# EAGLE schematic ZEGAR_WS2812 (EAGLE 9.6.0)
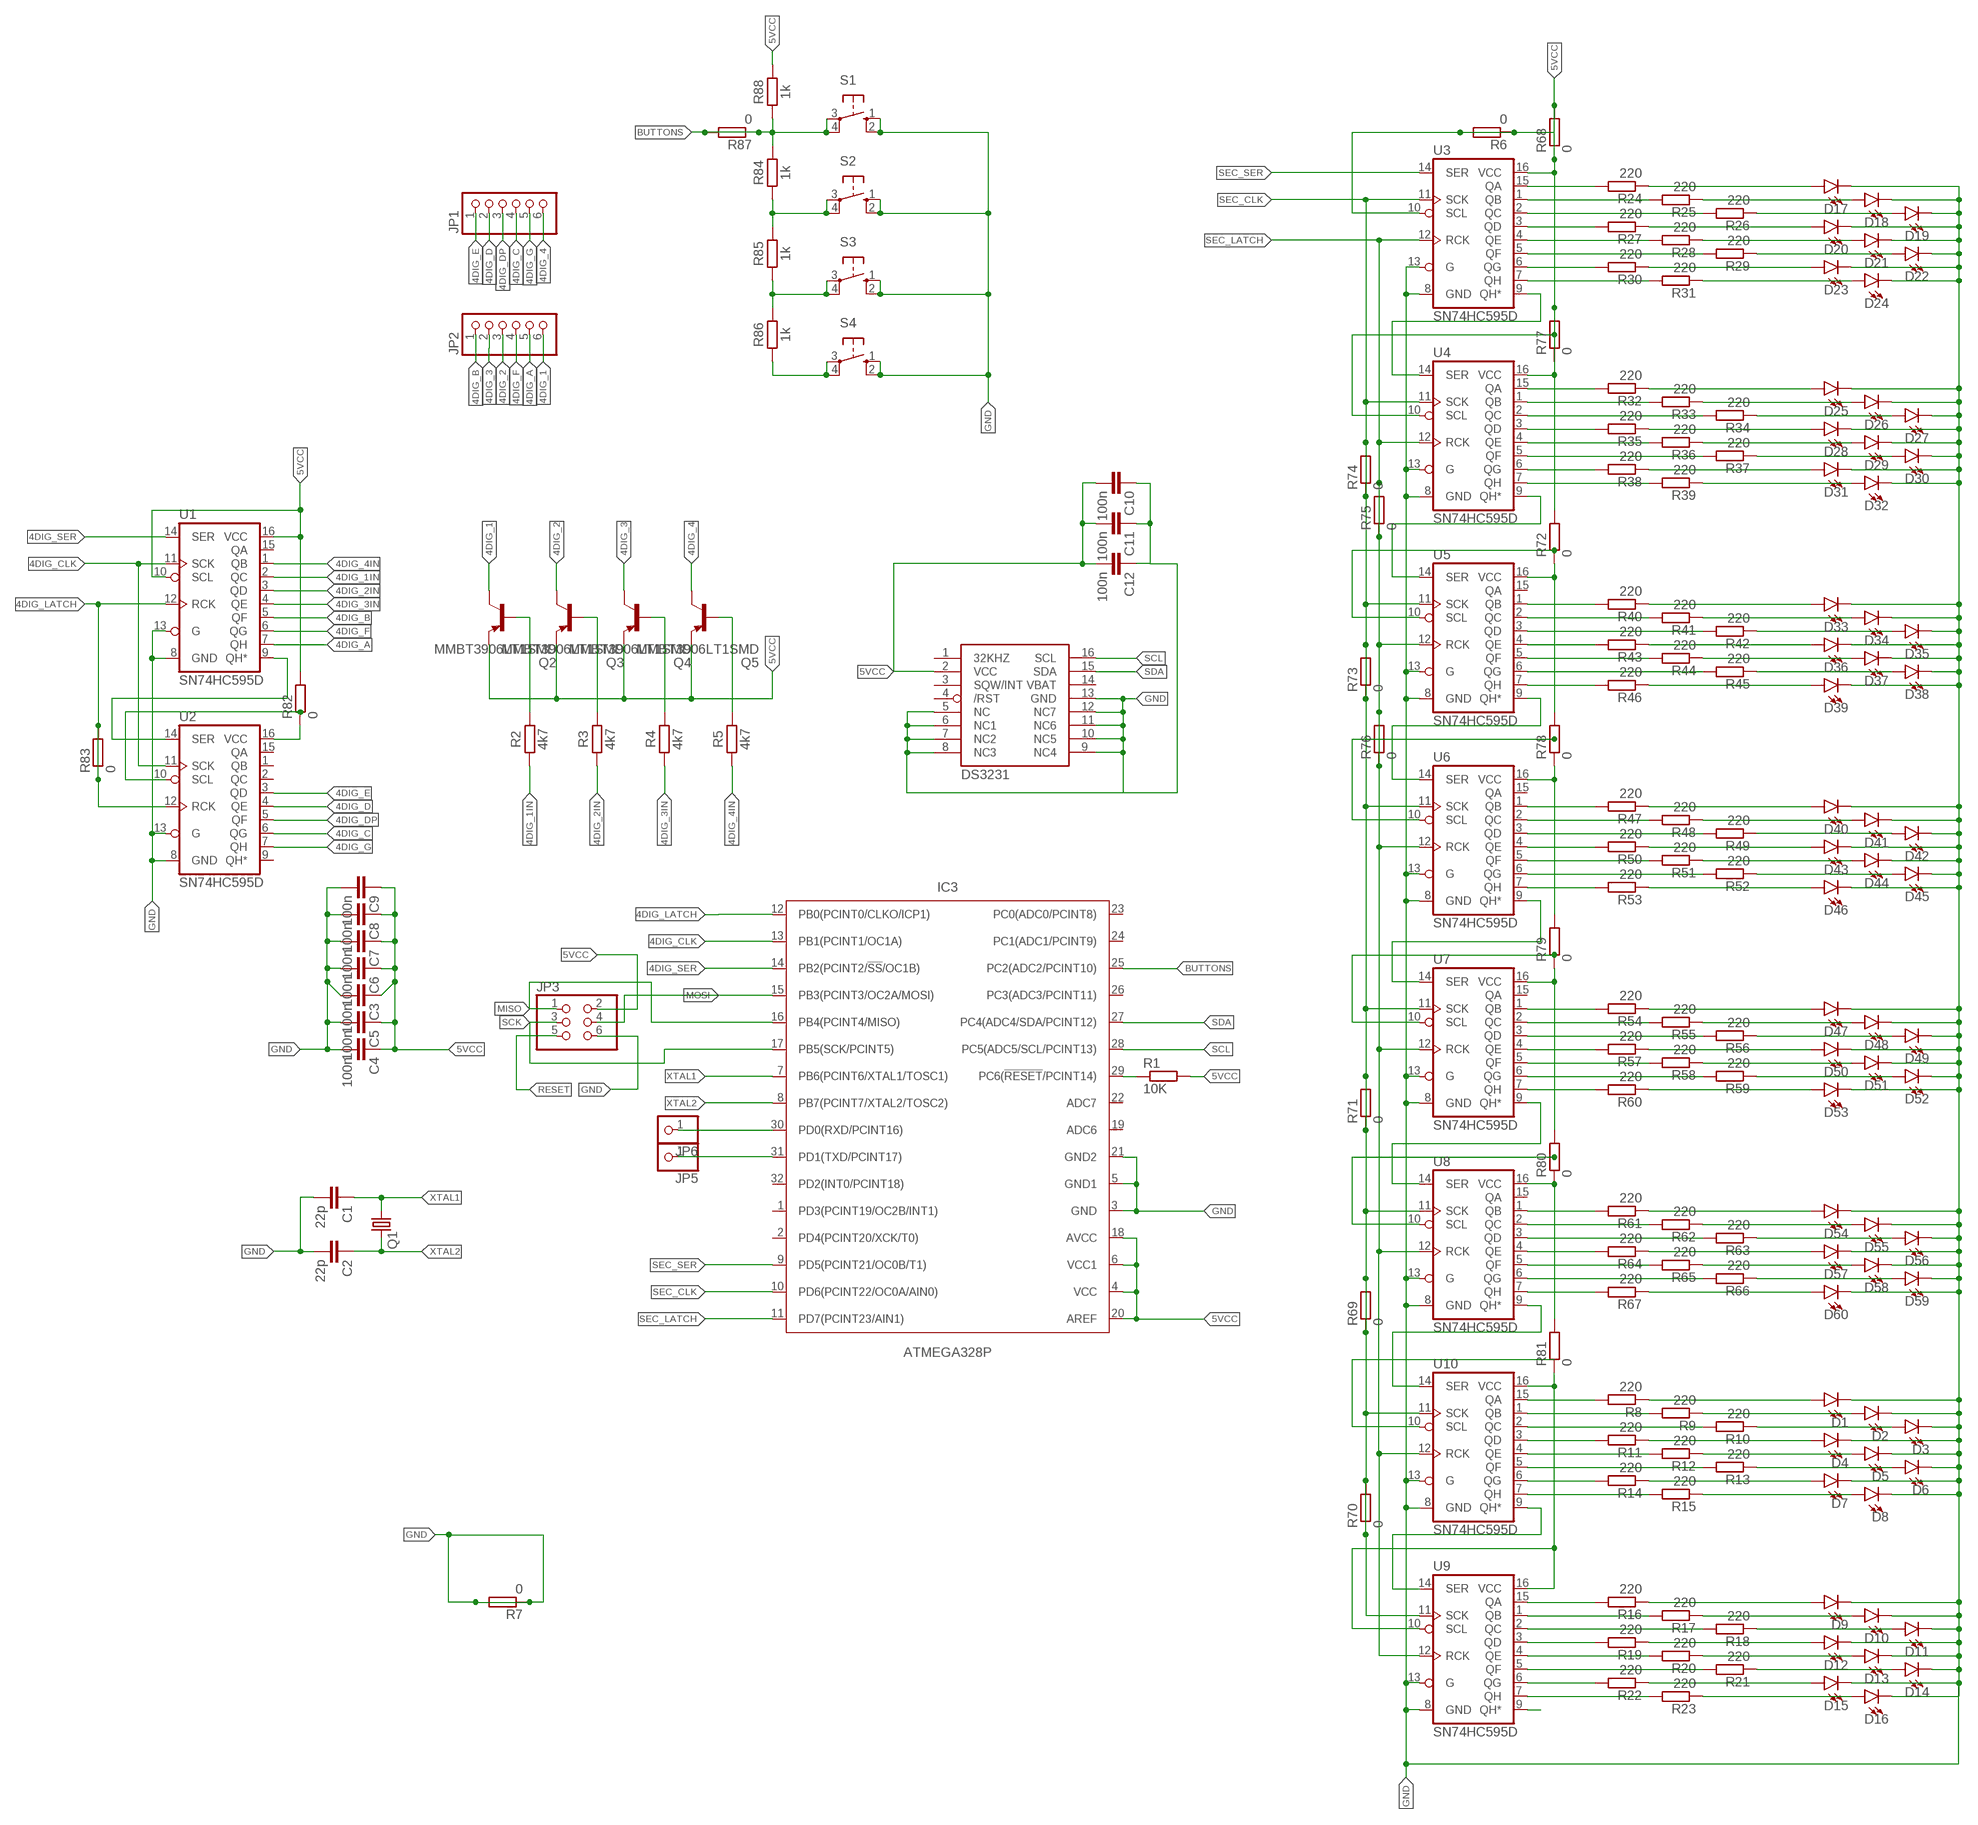
[diagram p0: schematic, sheet 1]

## Parts
C1  22p  C-EUC0805  [C0805]
C2  22p  C-EUC0805  [C0805]
C3  100n  C-EUC0805  [C0805]
C4  100n  C-EUC0805  [C0805]
C5  100n  C-EUC0805  [C0805]
C6  100n  C-EUC0805  [C0805]
C7  100n  C-EUC0805  [C0805]
C8  100n  C-EUC0805  [C0805]
C9  100n  C-EUC0805  [C0805]
C10  100n  C-EUC0805  [C0805]
C11  100n  C-EUC0805  [C0805]
C12  100n  C-EUC0805  [C0805]
D1  LED3MM  [LED_3MM]
D2  LED3MM  [LED_3MM]
D3  LED3MM  [LED_3MM]
D4  LED3MM  [LED_3MM]
D5  LED3MM  [LED_3MM]
D6  LED3MM  [LED_3MM]
D7  LED3MM  [LED_3MM]
D8  LED3MM  [LED_3MM]
D9  LED3MM  [LED_3MM]
D10  LED3MM  [LED_3MM]
D11  LED3MM  [LED_3MM]
D12  LED3MM  [LED_3MM]
D13  LED3MM  [LED_3MM]
D14  LED3MM  [LED_3MM]
D15  LED3MM  [LED_3MM]
D16  LED3MM  [LED_3MM]
D17  LED3MM  [LED_3MM]
D18  LED3MM  [LED_3MM]
D19  LED3MM  [LED_3MM]
D20  LED3MM  [LED_3MM]
D21  LED3MM  [LED_3MM]
D22  LED3MM  [LED_3MM]
D23  LED3MM  [LED_3MM]
D24  LED3MM  [LED_3MM]
D25  LED3MM  [LED_3MM]
D26  LED3MM  [LED_3MM]
D27  LED3MM  [LED_3MM]
D28  LED3MM  [LED_3MM]
D29  LED3MM  [LED_3MM]
D30  LED3MM  [LED_3MM]
D31  LED3MM  [LED_3MM]
D32  LED3MM  [LED_3MM]
D33  LED3MM  [LED_3MM]
D34  LED3MM  [LED_3MM]
D35  LED3MM  [LED_3MM]
D36  LED3MM  [LED_3MM]
D37  LED3MM  [LED_3MM]
D38  LED3MM  [LED_3MM]
D39  LED3MM  [LED_3MM]
D40  LED3MM  [LED_3MM]
D41  LED3MM  [LED_3MM]
D42  LED3MM  [LED_3MM]
D43  LED3MM  [LED_3MM]
D44  LED3MM  [LED_3MM]
D45  LED3MM  [LED_3MM]
D46  LED3MM  [LED_3MM]
D47  LED3MM  [LED_3MM]
D48  LED3MM  [LED_3MM]
D49  LED3MM  [LED_3MM]
D50  LED3MM  [LED_3MM]
D51  LED3MM  [LED_3MM]
D52  LED3MM  [LED_3MM]
D53  LED3MM  [LED_3MM]
D54  LED3MM  [LED_3MM]
D55  LED3MM  [LED_3MM]
D56  LED3MM  [LED_3MM]
D57  LED3MM  [LED_3MM]
D58  LED3MM  [LED_3MM]
D59  LED3MM  [LED_3MM]
D60  LED3MM  [LED_3MM]
IC2  DS3231/SO  [SO16W]
IC3  ATMEGA328P  ATMEGA328P_TQFP  [TQFP32-08]
JP1  PINHD-1X6  [1X06]
JP2  PINHD-1X6  [1X06]
JP3  PINHD-2X03_2.54-SMD  [2X03SMD]
JP5  PINHD-1X01_2.54-SMD-90°  [1X01SMD/90]
JP6  PINHD-1X01_2.54-SMD-90°  [1X01SMD/90]
Q1  KX-7  [3.2X2.5_KX-7]
Q2  MMBT3906LT1SMD  [SOT23-BEC]
Q3  MMBT3906LT1SMD  [SOT23-BEC]
Q4  MMBT3906LT1SMD  [SOT23-BEC]
Q5  MMBT3906LT1SMD  [SOT23-BEC]
R1  10K  R-EU_R0805  [R0805]
R2  4k7  RCHIP-0805(2012-METRIC)  [RESC2012X65]
R3  4k7  RCHIP-0805(2012-METRIC)  [RESC2012X65]
R4  4k7  RCHIP-0805(2012-METRIC)  [RESC2012X65]
R5  4k7  RCHIP-0805(2012-METRIC)  [RESC2012X65]
R6  0  R-EU_R2512  [R2512]
R7  0  R-EU_R1206  [R1206]
R8  220  R-EU_R0805  [R0805]
R9  220  R-EU_R0805  [R0805]
R10  220  R-EU_R0805  [R0805]
R11  220  R-EU_R0805  [R0805]
R12  220  R-EU_R0805  [R0805]
R13  220  R-EU_R0805  [R0805]
R14  220  R-EU_R0805  [R0805]
R15  220  R-EU_R0805  [R0805]
R16  220  R-EU_R0805  [R0805]
R17  220  R-EU_R0805  [R0805]
R18  220  R-EU_R0805  [R0805]
R19  220  R-EU_R0805  [R0805]
R20  220  R-EU_R0805  [R0805]
R21  220  R-EU_R0805  [R0805]
R22  220  R-EU_R0805  [R0805]
R23  220  R-EU_R0805  [R0805]
R24  220  R-EU_R0805  [R0805]
R25  220  R-EU_R0805  [R0805]
R26  220  R-EU_R0805  [R0805]
R27  220  R-EU_R0805  [R0805]
R28  220  R-EU_R0805  [R0805]
R29  220  R-EU_R0805  [R0805]
R30  220  R-EU_R0805  [R0805]
R31  220  R-EU_R0805  [R0805]
R32  220  R-EU_R0805  [R0805]
R33  220  R-EU_R0805  [R0805]
R34  220  R-EU_R0805  [R0805]
R35  220  R-EU_R0805  [R0805]
R36  220  R-EU_R0805  [R0805]
R37  220  R-EU_R0805  [R0805]
R38  220  R-EU_R0805  [R0805]
R39  220  R-EU_R0805  [R0805]
R40  220  R-EU_R0805  [R0805]
R41  220  R-EU_R0805  [R0805]
R42  220  R-EU_R0805  [R0805]
R43  220  R-EU_R0805  [R0805]
R44  220  R-EU_R0805  [R0805]
R45  220  R-EU_R0805  [R0805]
R46  220  R-EU_R0805  [R0805]
R47  220  R-EU_R0805  [R0805]
R48  220  R-EU_R0805  [R0805]
R49  220  R-EU_R0805  [R0805]
R50  220  R-EU_R0805  [R0805]
R51  220  R-EU_R0805  [R0805]
R52  220  R-EU_R0805  [R0805]
R53  220  R-EU_R0805  [R0805]
R54  220  R-EU_R0805  [R0805]
R55  220  R-EU_R0805  [R0805]
R56  220  R-EU_R0805  [R0805]
R57  220  R-EU_R0805  [R0805]
R58  220  R-EU_R0805  [R0805]
R59  220  R-EU_R0805  [R0805]
R60  220  R-EU_R0805  [R0805]
R61  220  R-EU_R0805  [R0805]
R62  220  R-EU_R0805  [R0805]
R63  220  R-EU_R0805  [R0805]
R64  220  R-EU_R0805  [R0805]
R65  220  R-EU_R0805  [R0805]
R66  220  R-EU_R0805  [R0805]
R67  220  R-EU_R0805  [R0805]
R68  0  R-EU_R2512  [R2512]
R69  0  R-EU_R1206  [R1206]
R70  0  R-EU_R1206  [R1206]
R71  0  R-EU_R1206  [R1206]
R72  0  R-EU_R2512  [R2512]
R73  0  R-EU_R1206  [R1206]
R74  0  R-EU_R1206  [R1206]
R75  0  R-EU_R1206  [R1206]
R76  0  R-EU_R1206  [R1206]
R77  0  R-EU_R2512  [R2512]
R78  0  R-EU_R2512  [R2512]
R79  0  R-EU_R2512  [R2512]
R80  0  R-EU_R2512  [R2512]
R81  0  R-EU_R2512  [R2512]
R82  0  R-EU_R2512  [R2512]
R83  0  R-EU_R2512  [R2512]
R84  1k  RCHIP-0805(2012-METRIC)  [RESC2012X65]
R85  1k  RCHIP-0805(2012-METRIC)  [RESC2012X65]
R86  1k  RCHIP-0805(2012-METRIC)  [RESC2012X65]
R87  0  R-EU_R2512  [R2512]
R88  1k  RCHIP-0805(2012-METRIC)  [RESC2012X65]
S1  10-XX  [B3F-10XX]
S2  10-XX  [B3F-10XX]
S3  10-XX  [B3F-10XX]
S4  10-XX  [B3F-10XX]
U1  SN74HC595D  74HC595D  [SO16]
U2  SN74HC595D  74HC595D  [SO16]
U3  SN74HC595D  74HC595D  [SO16]
U4  SN74HC595D  74HC595D  [SO16]
U5  SN74HC595D  74HC595D  [SO16]
U6  SN74HC595D  74HC595D  [SO16]
U7  SN74HC595D  74HC595D  [SO16]
U8  SN74HC595D  74HC595D  [SO16]
U9  SN74HC595D  74HC595D  [SO16]
U10  SN74HC595D  74HC595D  [SO16]

## Nets
4DIG_1: JP2.6 Q2.C
4DIG_1IN: R2.1 U1.2(QC)
4DIG_2: JP2.3 Q3.C
4DIG_2IN: R3.1 U1.3(QD)
4DIG_3: JP2.2 Q4.C
4DIG_3IN: R4.1 U1.4(QE)
4DIG_4: JP1.6 Q5.C
4DIG_4IN: R5.1 U1.1(QB)
4DIG_A: JP2.5 U1.7(QH)
4DIG_B: JP2.1 U1.5(QF)
4DIG_C: JP1.4 U2.6(QG)
4DIG_CLK: IC3.13(PB1(PCINT1/OC1A)) U1.11(SCK) U2.11(SCK)
4DIG_D: JP1.2 U2.4(QE)
4DIG_DP: JP1.3 U2.5(QF)
4DIG_E: JP1.1 U2.3(QD)
4DIG_F: JP2.4 U1.6(QG)
4DIG_G: JP1.5 U2.7(QH)
4DIG_LATCH: IC3.12(PB0(PCINT0/CLKO/ICP1)) R83.1 R83.2 U1.12(RCK) U2.12(RCK)
4DIG_SER: IC3.14(PB2(PCINT2/!SS!/OC1B)) U1.14(SER)
5VCC: C3.1 C4.1 C5.1 C6.1 C7.1 C8.1 C9.1 C10.2 C11.2 C12.2 IC2.2(VCC) IC3.4(VCC) IC3.6(VCC1) IC3.18(AVCC) IC3.20(AREF) JP3.2 Q2.E Q3.E Q4.E Q5.E R1.2 R6.1 R6.2 R68.1 R68.2 R72.1 R72.2 R77.1 R77.2 R78.1 R78.2 R79.1 R79.2 R80.1 R80.2 R81.1 R81.2 R82.1 R82.2 R88.2 U1.10(SCL) U1.16(VCC) U2.10(SCL) U2.16(VCC) U3.10(SCL) U3.16(VCC) U4.10(SCL) U4.16(VCC) U5.10(SCL) U5.16(VCC) U6.10(SCL) U6.16(VCC) U7.10(SCL) U7.16(VCC) U8.10(SCL) U8.16(VCC) U9.10(SCL) U9.16(VCC) U10.10(SCL) U10.16(VCC)
BUTTONS: IC3.25(PC2(ADC2/PCINT10)) R84.2 R87.1 R87.2 R88.1 S1.3(P) S1.4(P1)
GND: C1.2 C2.2 C3.2 C4.2 C5.2 C6.2 C7.2 C8.2 C9.2 C10.1 C11.1 C12.1 D1.K(C) D2.K(C) D3.K(C) D4.K(C) D5.K(C) D6.K(C) D7.K(C) D8.K(C) D9.K(C) D10.K(C) D11.K(C) D12.K(C) D13.K(C) D14.K(C) D15.K(C) D16.K(C) D17.K(C) D18.K(C) D19.K(C) D20.K(C) D21.K(C) D22.K(C) D23.K(C) D24.K(C) D25.K(C) D26.K(C) D27.K(C) D28.K(C) D29.K(C) D30.K(C) D31.K(C) D32.K(C) D33.K(C) D34.K(C) D35.K(C) D36.K(C) D37.K(C) D38.K(C) D39.K(C) D40.K(C) D41.K(C) D42.K(C) D43.K(C) D44.K(C) D45.K(C) D46.K(C) D47.K(C) D48.K(C) D49.K(C) D50.K(C) D51.K(C) D52.K(C) D53.K(C) D54.K(C) D55.K(C) D56.K(C) D57.K(C) D58.K(C) D59.K(C) D60.K(C) IC2.5(NC) IC2.6(NC1) IC2.7(NC2) IC2.8(NC3) IC2.9(NC4) IC2.10(NC5) IC2.11(NC6) IC2.12(NC7) IC2.13(GND) IC3.3(GND) IC3.5(GND1) IC3.21(GND2) JP3.6 R7.1 R7.2 S1.1(S) S1.2(S1) S2.1(S) S2.2(S1) S3.1(S) S3.2(S1) S4.1(S) S4.2(S1) U1.8(GND) U1.13(G) U2.8(GND) U2.13(G) U3.8(GND) U3.13(G) U4.8(GND) U4.13(G) U5.8(GND) U5.13(G) U6.8(GND) U6.13(G) U7.8(GND) U7.13(G) U8.8(GND) U8.13(G) U9.8(GND) U9.13(G) U10.8(GND) U10.13(G)
MISO: IC3.16(PB4(PCINT4/MISO)) JP3.1
MOSI: IC3.15(PB3(PCINT3/OC2A/MOSI)) JP3.4
N$1: U1.9(QH*) U2.14(SER)
N$2: U9.14(SER) U10.9(QH*)
N$4: R8.2 U10.15(QA)
N$5: R9.2 U10.1(QB)
N$6: R10.2 U10.2(QC)
N$7: R11.2 U10.3(QD)
N$8: R12.2 U10.4(QE)
N$9: R13.2 U10.5(QF)
N$10: U7.9(QH*) U8.14(SER)
N$11: U6.9(QH*) U7.14(SER)
N$12: U5.9(QH*) U6.14(SER)
N$13: U4.9(QH*) U5.14(SER)
N$14: U3.9(QH*) U4.14(SER)
N$15: R14.2 U10.6(QG)
N$16: R15.2 U10.7(QH)
N$17: R16.2 U9.15(QA)
N$18: Q2.B R2.2
N$19: Q3.B R3.2
N$20: Q4.B R4.2
N$21: Q5.B R5.2
N$22: R17.2 U9.1(QB)
N$23: R18.2 U9.2(QC)
N$24: R19.2 U9.3(QD)
N$25: R20.2 U9.4(QE)
N$26: R21.2 U9.5(QF)
N$27: R22.2 U9.6(QG)
N$28: R23.2 U9.7(QH)
N$29: R24.2 U3.15(QA)
N$30: R25.2 U3.1(QB)
N$31: R26.2 U3.2(QC)
N$32: R27.2 U3.3(QD)
N$33: R28.2 U3.4(QE)
N$34: R29.2 U3.5(QF)
N$35: R30.2 U3.6(QG)
N$36: R31.2 U3.7(QH)
N$37: R32.2 U4.15(QA)
N$38: R33.2 U4.1(QB)
N$39: R34.2 U4.2(QC)
N$40: R35.2 U4.3(QD)
N$41: R36.2 U4.4(QE)
N$42: R37.2 U4.5(QF)
N$43: R38.2 U4.6(QG)
N$44: R39.2 U4.7(QH)
N$45: R47.2 U6.1(QB)
N$46: R40.2 U5.1(QB)
N$47: R41.2 U5.2(QC)
N$48: R42.2 U5.3(QD)
N$49: R43.2 U5.4(QE)
N$50: R44.2 U5.5(QF)
N$51: R45.2 U5.6(QG)
N$52: R46.2 U5.7(QH)
N$53: R48.2 U6.2(QC)
N$54: R49.2 U6.3(QD)
N$55: R50.2 U6.4(QE)
N$56: R51.2 U6.5(QF)
N$57: R52.2 U6.6(QG)
N$58: R53.2 U6.7(QH)
N$59: R54.2 U7.1(QB)
N$60: R55.2 U7.2(QC)
N$61: R56.2 U7.3(QD)
N$62: R57.2 U7.4(QE)
N$63: R58.2 U7.5(QF)
N$64: R59.2 U7.6(QG)
N$65: R60.2 U7.7(QH)
N$66: R61.2 U8.1(QB)
N$67: R62.2 U8.2(QC)
N$68: R63.2 U8.3(QD)
N$69: R64.2 U8.4(QE)
N$70: R65.2 U8.5(QF)
N$71: R66.2 U8.6(QG)
N$72: R67.2 U8.7(QH)
N$73: D1.A R8.1
N$74: D2.A R9.1
N$75: D4.A R11.1
N$76: D3.A R10.1
N$77: D7.A R14.1
N$78: D5.A R12.1
N$79: D6.A R13.1
N$80: D8.A R15.1
N$81: D9.A R16.1
N$82: D12.A R19.1
N$83: D15.A R22.1
N$84: D17.A R24.1
N$85: D18.A R25.1
N$86: D19.A R26.1
N$87: D10.A R17.1
N$88: D13.A R20.1
N$89: D11.A R18.1
N$90: D16.A R23.1
N$91: D14.A R21.1
N$92: D23.A R30.1
N$93: D22.A R29.1
N$94: D21.A R28.1
N$95: D20.A R27.1
N$96: D24.A R31.1
N$97: D25.A R32.1
N$98: D26.A R33.1
N$99: D27.A R34.1
N$100: D28.A R35.1
N$101: D29.A R36.1
N$102: D30.A R37.1
N$103: D31.A R38.1
N$104: D32.A R39.1
N$105: D33.A R40.1
N$106: D34.A R41.1
N$107: D35.A R42.1
N$108: D36.A R43.1
N$109: D37.A R44.1
N$110: D38.A R45.1
N$111: D39.A R46.1
N$112: D40.A R47.1
N$113: D41.A R48.1
N$114: D42.A R49.1
N$115: D43.A R50.1
N$116: D44.A R51.1
N$117: D45.A R52.1
N$118: D46.A R53.1
N$119: D47.A R54.1
N$120: D48.A R55.1
N$121: D49.A R56.1
N$122: D50.A R57.1
N$123: D51.A R58.1
N$124: D52.A R59.1
N$125: D53.A R60.1
N$126: D54.A R61.1
N$127: D55.A R62.1
N$128: D56.A R63.1
N$129: D57.A R64.1
N$130: D60.A R67.1
N$131: D59.A R66.1
N$132: D58.A R65.1
N$133: U9.9(QH*)
N$135: IC3.30(PD0(RXD/PCINT16)) JP6.1
N$136: IC3.31(PD1(TXD/PCINT17)) JP5.1
N$138: R84.1 R85.2 S2.3(P) S2.4(P1)
N$139: R85.1 R86.2 S3.3(P) S3.4(P1)
N$140: R86.1 S4.3(P) S4.4(P1)
RESET: IC3.29(PC6(!RESET!/PCINT14)) JP3.5 R1.1
SCK: IC3.17(PB5(SCK/PCINT5)) JP3.3
SCL: IC2.16(SCL) IC3.28(PC5(ADC5/SCL/PCINT13))
SDA: IC2.15(SDA) IC3.27(PC4(ADC4/SDA/PCINT12))
SEC_CLK: IC3.10(PD6(PCINT22/OC0A/AIN0)) R69.1 R69.2 R70.1 R70.2 R71.1 R71.2 R73.1 R73.2 R74.1 R74.2 U3.11(SCK) U4.11(SCK) U5.11(SCK) U6.11(SCK) U7.11(SCK) U8.11(SCK) U9.11(SCK) U10.11(SCK)
SEC_LATCH: IC3.11(PD7(PCINT23/AIN1)) R75.1 R75.2 R76.1 R76.2 U3.12(RCK) U4.12(RCK) U5.12(RCK) U6.12(RCK) U7.12(RCK) U8.12(RCK) U9.12(RCK) U10.12(RCK)
SEC_SER: IC3.9(PD5(PCINT21/OC0B/T1)) U3.14(SER)
SEC_SERIAL: U8.9(QH*) U10.14(SER)
XTAL1: C1.1 IC3.7(PB6(PCINT6/XTAL1/TOSC1)) Q1.1
XTAL2: C2.1 IC3.8(PB7(PCINT7/XTAL2/TOSC2)) Q1.3
Unconnected: IC2.1(32KHZ) IC2.3(SQW/INT) IC2.4(/RST) IC3.1(PD3(PCINT19/OC2B/INT1)) IC3.2(PD4(PCINT20/XCK/T0)) IC3.19(ADC6) IC3.22(ADC7) IC3.23(PC0(ADC0/PCINT8)) IC3.24(PC1(ADC1/PCINT9)) IC3.26(PC3(ADC3/PCINT11)) IC3.32(PD2(INT0/PCINT18)) U1.15(QA) U2.1(QB) U2.2(QC) U2.9(QH*) U2.15(QA) U5.15(QA) U6.15(QA) U7.15(QA) U8.15(QA)

## Power pins joined to a net without a drawn wire
VBAT: IC2.14(VBAT)

## Library data of the parts
C1-C12 = rcl:C-EU: CAPACITOR, European symbol; SPICEPREFIX: C
D1-D60 = SparkFun-LED:LED: LED (Generic) Standard schematic elements and footprints for 5mm, 3mm, 1206, and 0603 sized LEDs. Generic LEDs with no color specified.; PROD_ID: DIO-08794
IC2 = adafruit:DS3231
IC3 = IC_Embedded:ATMEGA328P: 8-bit AVR Microcontroller with 32K Bytes In-System Programmable Flash Datasheet <http://ww1.microchip.com/downloads/en/DeviceDoc/Atmel-7810-Automotive-Microcontrollers-ATmega328P_Datasheet.pdf>; CATEGORY: IC_Embedded; MANUFACTURER: Microchip; MPN: ATmega328P-MMH; OPERATING_TEMP: -40 to 85 °C; PART_STATUS: Active; SUB-CATEGORY: Microcontroller
JP1 JP2 = pinhead:PINHD-1X6: PIN HEADER
JP3 = pinhead-2:PINHD-2X03: PIN HEADER
JP5 JP6 = pinhead-2:PINHD-1X01: PIN HEADER
Q1 = crystal-geyer_V1_0:KX: Quartz Crystals (MHz) SMD: KX - Serie Model Size l/w/h [mm] Frequency Range Frequency Stability Temp. Range [°C] Load Capacitance AECQ 200 availabel Datasheet KX-4 KX-5 KX-6 KX-7 KX-9A KX-9B KX-12A KX-12B KX-13 KX-20 KX-K KX-KS 1.6/1.2/0.3 2.0/1.6/0.45 2.5/2.0/0.55 3.2/2.5/0.8 5.0/3.2/1.0 5.0/3.2/1.1 6.0/3.5/1.1 6.0/3.5/1.0 7.0/5.0 /1.3 11.6/5.5/1.6 12.3/4.5/4.2 12.3/4.5/3.2 24.0 ~ 80.0 MHz 16.0 ~ 80.0 MHz 12.0 ~ 80.0 MHz 8.0 ~ 60.0 MHz 7,68 ~ 300,0 MHz 8,0 ~ 50,0 MHz 8,0 ~ 150,0 MHz 8,0 ~ 50,0 MHz 6,0 ~ 160,0 MHz 3,579 ~ 25,0 MHz 3,579 ~ 70,0 MHz 3,579 ~ 70,0 MHz ±10 … ±50ppm ±10 … ±50ppm ±10 … ±50ppm ±10 … ±50ppm ±10 … ±50ppm ±10 … ±50ppm ±10 … ±50ppm ±10 … ±50ppm ±10 … ±50ppm ±50ppm ±10 … ±50ppm ±10 … ±50ppm (*) -40°C …+85°C (*) -40°C …+125°C (*) -40°C …+125°C (*) -40°C …+125°C (*) -40°C …+105°C (*) -40°C …+105°C (*) -40°C …+125°C (*) -40°C …+105°C (*) -40°C …+105°C (*) -40°C …+105°C (*) -40°C …+85°C (*) -40°C …+85°C 8, 8…16 8, 8…16 10, 8…16 12, 7…20 16, 10…20 16, 10…20 16, 10…20 16, 12…20 16, 12…20 16, 12…20 16, 12…30 16, 12…30 - yes yes yes - - - - - - - - KX-4.pdf <http://www.geyer-electronic.de/uploads/tx_userartikelfrequenz/GEYER-KX-4.pdf> KX-5.pdf <http://www.geyer-electronic.de/uploads/tx_userartikelfrequenz/GEYER-KX-5.pdf> KX-6.pdf <http://www.geyer-electronic.de/uploads/tx_userartikelfrequenz/GEYER-KX-6.pdf> KX-7.pdf <http://www.geyer-electronic.de/uploads/tx_userartikelfrequenz/GEYER-KX-7.pdf> KX-9A.pdf <http://www.geyer-electronic.de/uploads/tx_userartikelfrequenz/GEYER-KX-9A.pdf> KX-9B.pdf <http://www.geyer-electronic.de/uploads/tx_userartikelfrequenz/GEYER-KX-9B.pdf> KX-12A.pdf <http://www.geyer-electronic.de/uploads/tx_userartikelfrequenz/GEYER-KX-12A.pdf> KX-12B.pdf <http://www.geyer-electronic.de/uploads/tx_userartikelfrequenz/GEYER-KX-12B.pdf> KX-13.pdf <http://www.geyer-electronic.de/uploads/tx_userartikelfrequenz/GEYER-KX-13.pdf> KX-20.pdf <http://www.geyer-electronic.de/uploads/tx_userartikelfrequenz/GEYER-KX-20.pdf> KX-K.pdf <http://www.geyer-electronic.de/uploads/tx_userartikelfrequenz/GEYER-KX-K.pdf> KX-KS.pdf <http://www.geyer-electronic.de/uploads/tx_userartikelfrequenz/GEYER-KX-KS.pdf> <http://www.geyer-electronic.de/fileadmin/template/img/logo-geyer-electronic.png> Details see: http://www.geyer-electronic.de/Frequenz-Produkte.9.0.html Created 2016-06-07, Hans Locher 2016 (C) Geyer Quartz Technology KX4,KX5,KX6,KX7,KX9A,KX9B,KX12A,KX12B,KX13,KX20,KXK,KXKS;1612;2016;2520;3225;5032;6035;7050;11655;12345;1,6x1,2;2,0x1,6;2,5x2,0;3,2x2,5;5,0x3,2;6,0x3,5;7,0x5,0;11,6x5,5;12,3x4,5;12,3x4,5;1.6x1.2;2.0x1.6;2.5x2.0;3.2x2.5;5.0x3.2;6.0x3.5;7.0x5.0;11.6x5.5;12.3x4.5;12.3x4.5;
Q2-Q5 = transistor-pnp:MMBT3906*: PNP Transistror
R1 R6-R83 R87 = rcl:R-EU_: RESISTOR, European symbol; SPICEPREFIX: R
R2-R5 R84-R86 R88 = Resistor:R: Resistor Fixed - Generic; CATEGORY: Resistor; SUB-CATEGORY: Fixed
S1-S4 = switch-omron:10-XX: OMRON SWITCH; MPN: B3F-1000; OC_FARNELL: 176432; OC_NEWARK: 36M3542
U1-U10 = SparkFun-IC-Logic:74*595: 8-Bit Shift Register (Serial to Parallel) Datasheet <http://cdn.sparkfun.com/datasheets/BreakoutBoards/MM74HC595.pdf> SparkFun Products SparkFun Shift Register Breakout - 74HC595 <https://www.sparkfun.com/products/10680> (BOB-10680); PROD_ID: IC-07875